# Altium project QANTUM_PROJECT.PrjPcb (part 3 of 3)

## Sheet 09-USBUart_PPSMUX_UARTMUX.SchDoc
size 594 x 420 mm; SPICEModelCacheLIOYUQKN: <root> / <DocumentId>LIOYUQKN</DocumentId> / <CacheFrame Number="0"> / <Model Name="emk105bj105_v-f" Kind="CKT"> / <Text>* EMK105BJ105_V-F     SPICE MODEL  ( General Type ) / *-------------------------------------------------------------------------------------------------------- / * Model Generated by TAIYO YUDEN Corporation (http://www.ty-top.com) / * Version 1.0 / * TAIYO YUDEN Control No. 170508_130520 / * Copyright(c) 2012 TAIYO YUDEN CO.,LTD. All Rights Reserved. / *-------------------------------------------------------------------------------------------------------- / * / * Products Name : Multilayer Ceramic Capacitors / * / * Characteristics : / *     Capacitance : 1 uF , Rated Voltage : 16V , TCC : X5R / *     Case Size : 1.0 x 0.5 / 0.039 x 0.02 [mm/inch] , Thickness : 0.5 / 0.02 [mm/inch] / *     (Conditions: Temperature = 25 degC , DC Bias Current/Voltage = 0A / 0V) / * / * Frequency Range : 40Hz - 3GHz / * / * External Node Assignments : / * / *  1  o---| |---o  2 / * / *-------------------------------------------------------------------------------------------------------- / .SubCkt EMK105BJ105_V-F 1 2 / **************************** / C0 1 110 0.68309u / Cm 1 101 0.26053u / C1 101 102 0.94076u / Rc1 101 102 1.9029k / C2 102 103 0.66707u / Rc2 102 103 120.36 / C3 103 110 0.57203u / Rc3 103 110 2.1097 / C2m 1 301 0.1871u / C21 301 302 3.2494u / Rc21 301 302 1.1117k / C22 302 303 2.1014u / Rc22 302 303 1.484k / C23 303 304 2.1172u / Rc23 303 304 1.3876k / C24 304 305 0.75729u / Rc24 304 305 332.59 / C25 305 306 0.94401u / Rc25 305 306 249.09 / C26 306 307 0.34674u / Rc26 306 307 28.352 / C27 307 308 0.37158u / Rc27 307 308 19.989 / C28 308 309 0.17933u / Rc28 308 309 31.748 / C29 309 110 0.016445u / Rc29 309 110 1.0592 / Rp0 1 110 100Meg / L0 110 120 0.2216n / Lm 120 130 0.1509n / L1 120 121 0.12659n / RL1 121 130 0.85161 / L2 120 122 0.15996n / RL2 122 130 0.42469 / L3 120 123 7.9543n / RL3 123 130 0.54643m / CR 120 124 0.24334u / LR 124 125 0.090738n / RR 125 130 68.076m / CL 130 140 2.7354p / LL 130 140 0.10762n / RL 130 140 50.614 / Rs 140 2 7.5416m / **************************** / .ends EMK105BJ105_V-F</Text> / </Model> / </CacheFrame> / </root>
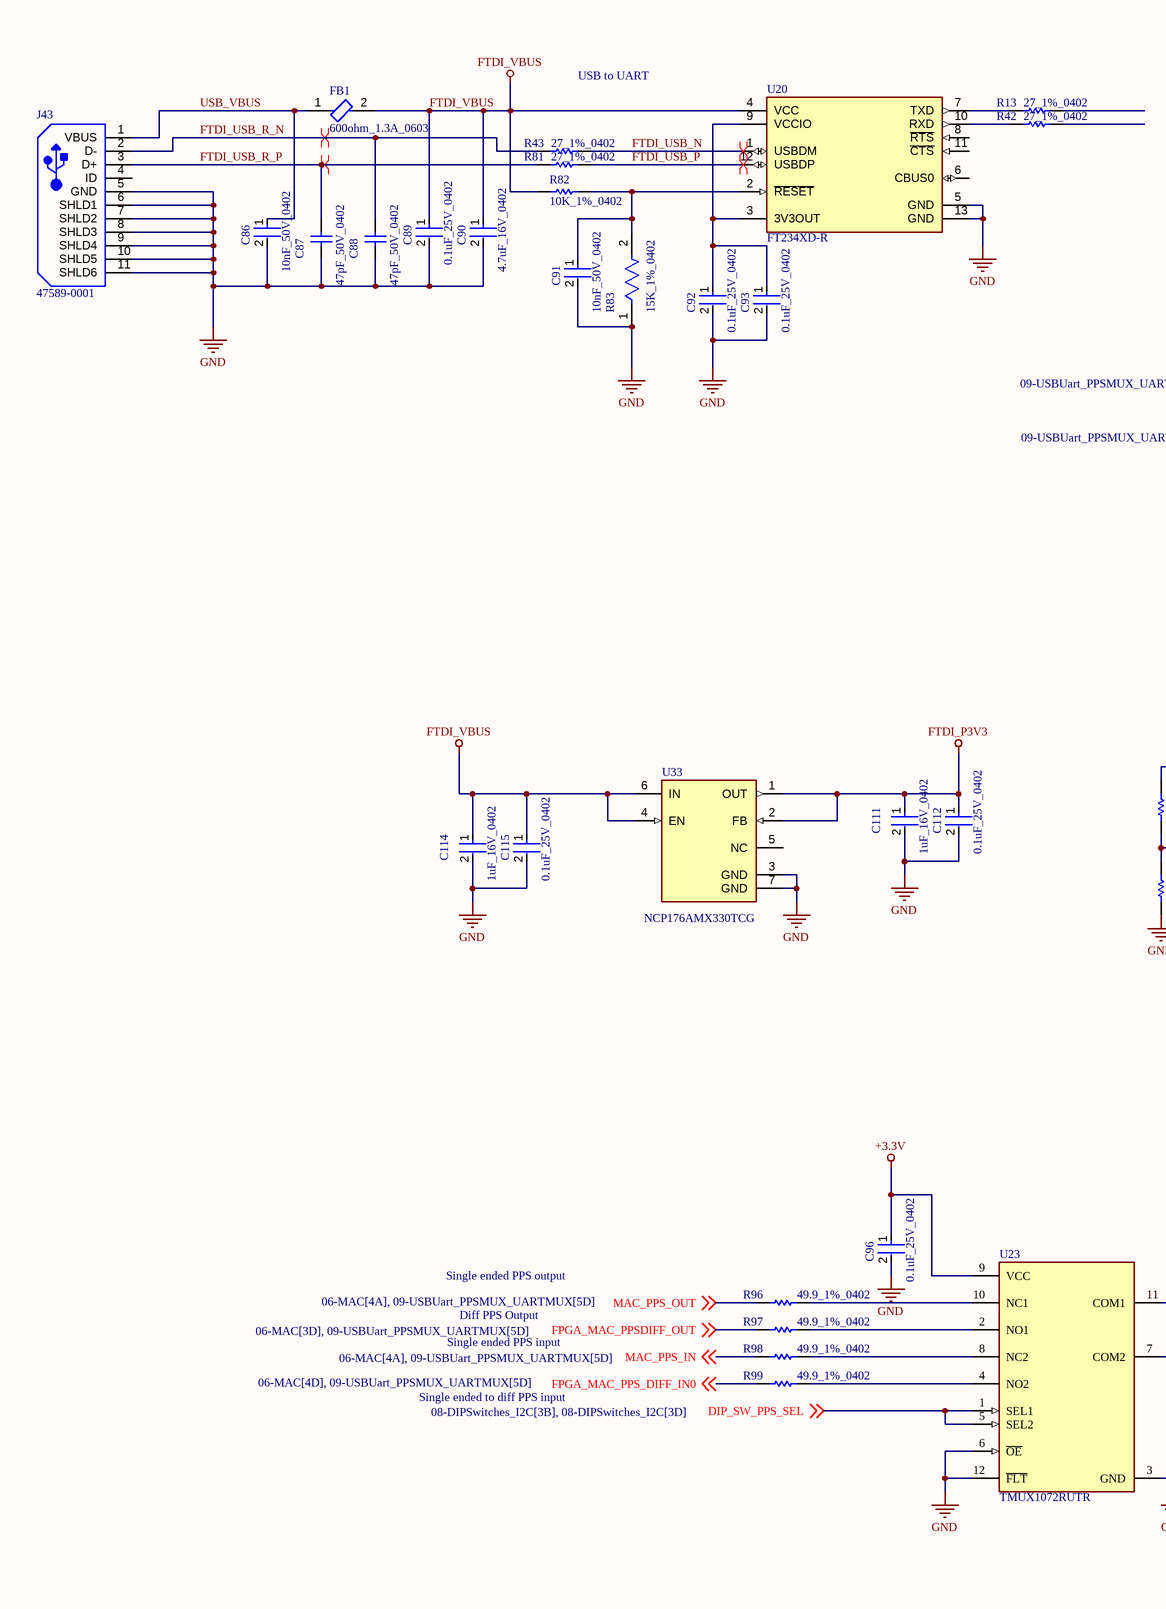
[diagram p10: 09-USBUart_PPSMUX_UARTMUX.SchDoc, left]
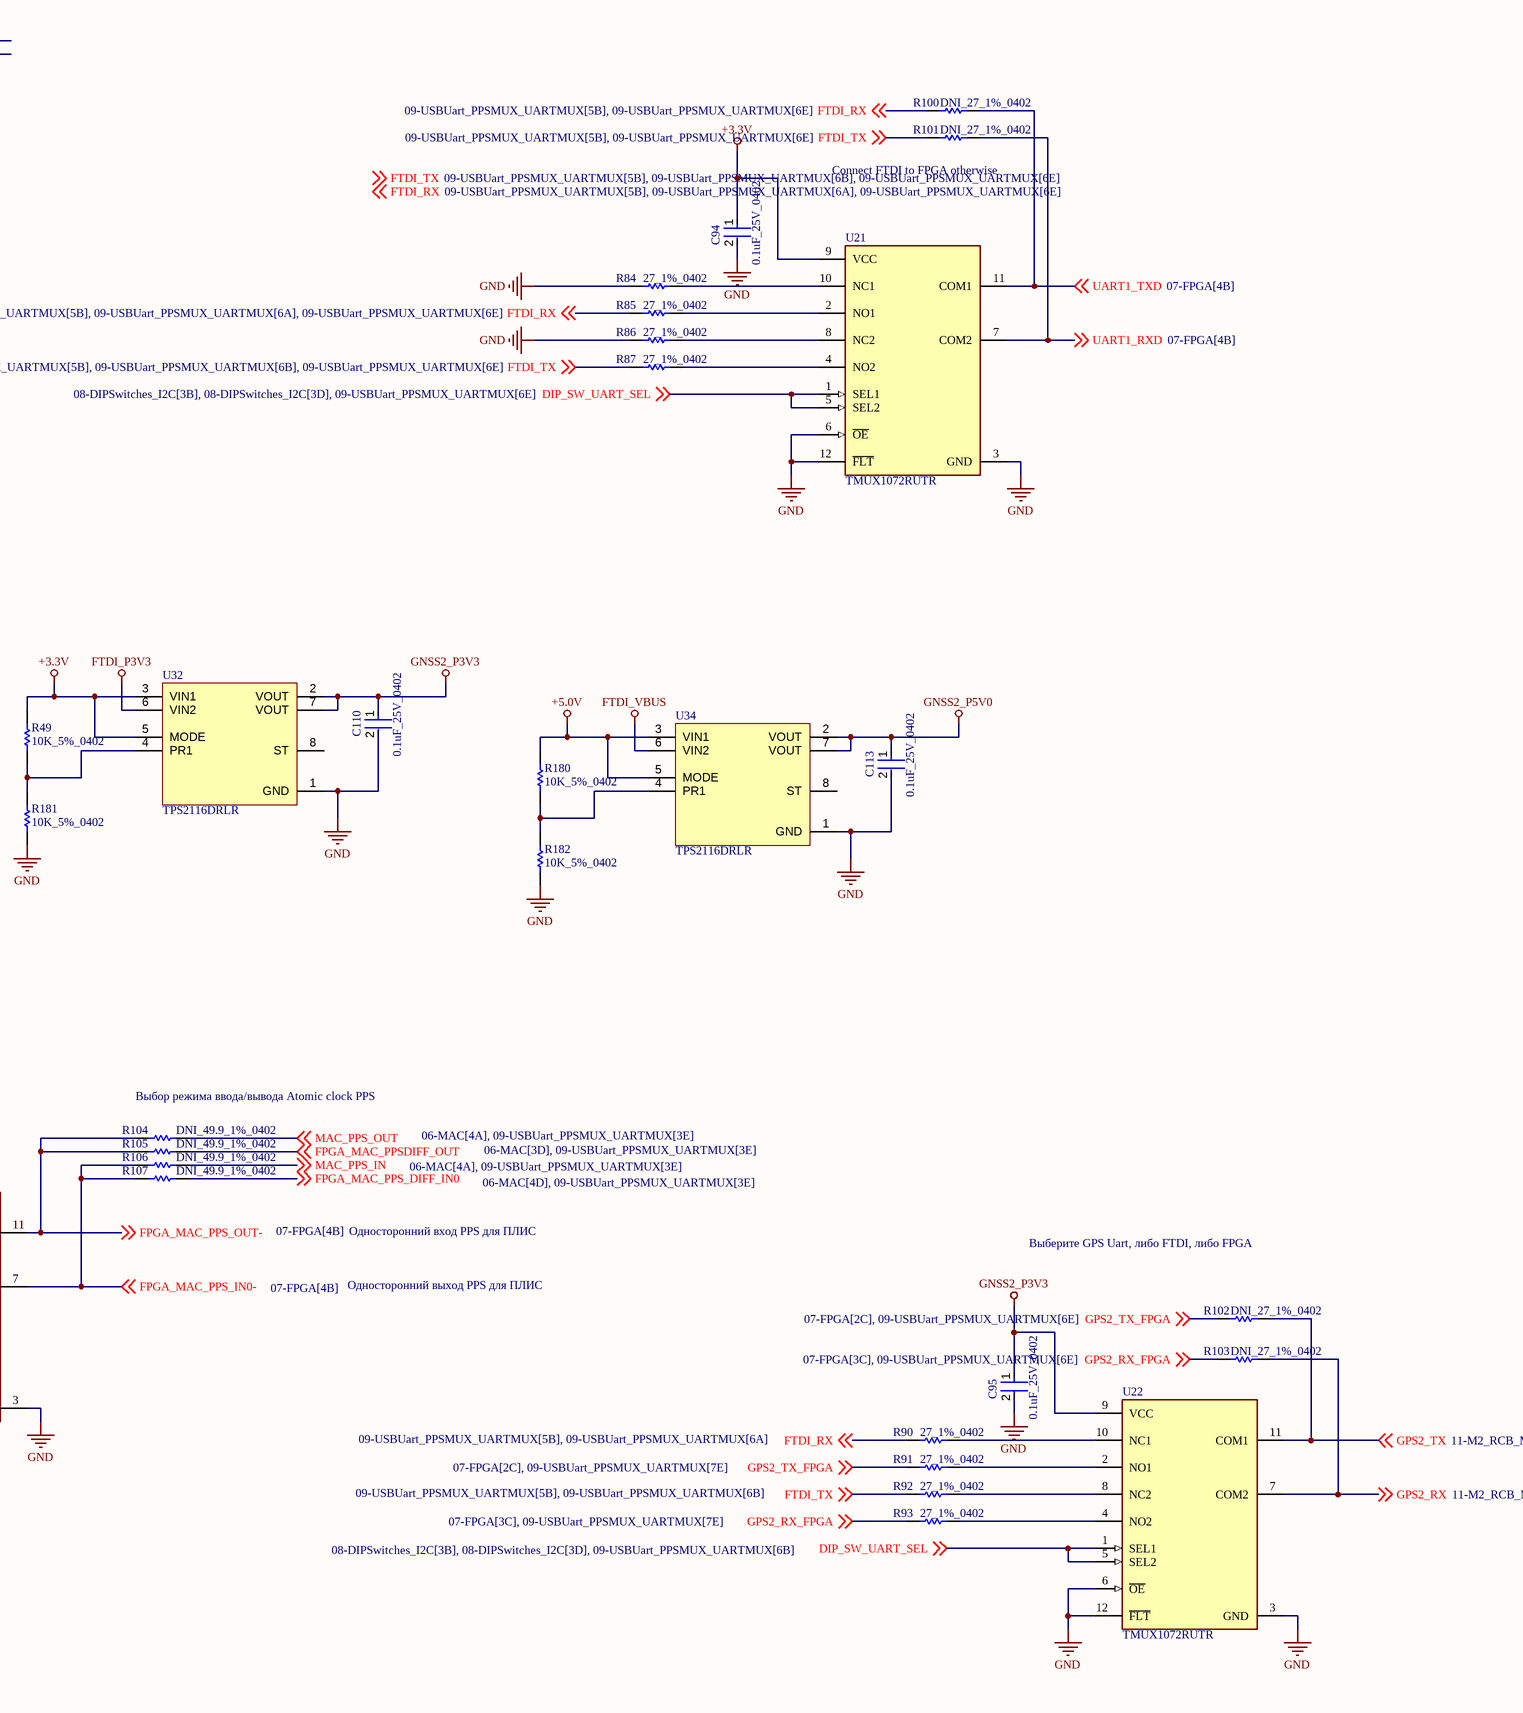
[diagram p11: 09-USBUart_PPSMUX_UARTMUX.SchDoc, right]

### Parts
C86  10nF_50V_0402  [FP-CC0402-MFG]
C87  47pF_50V_0402  [CAPC1005X55X25LL05T10]
C88  47pF_50V_0402  [CAPC1005X55X25LL05T10]
C89  0.1uF_25V_0402  [FP-0402-L_1_0_1-W_0_5_0_1-IPC_C]
C90  4.7uF_16V_0402  [FP-CL829-IPC_C]
C91  10nF_50V_0402  [FP-CC0402-MFG]
C92  0.1uF_25V_0402  [FP-0402-L_1_0_1-W_0_5_0_1-IPC_C]
C93  0.1uF_25V_0402  [FP-0402-L_1_0_1-W_0_5_0_1-IPC_C]
C94  0.1uF_25V_0402  [FP-0402-L_1_0_1-W_0_5_0_1-IPC_C]
C95  0.1uF_25V_0402  [FP-0402-L_1_0_1-W_0_5_0_1-IPC_C]
C96  0.1uF_25V_0402  [FP-0402-L_1_0_1-W_0_5_0_1-IPC_C]
C110  0.1uF_25V_0402  [FP-0402-L_1_0_1-W_0_5_0_1-IPC_C]
C111  1uF_16V_0402  [FP-0402-L_1_0_0_05-W_0_5-IPC_A]
C112  0.1uF_25V_0402  [FP-0402-L_1_0_1-W_0_5_0_1-IPC_C]
C113  0.1uF_25V_0402  [FP-0402-L_1_0_1-W_0_5_0_1-IPC_C]
C114  1uF_16V_0402  [FP-0402-L_1_0_0_05-W_0_5-IPC_A]
C115  0.1uF_25V_0402  [FP-0402-L_1_0_1-W_0_5_0_1-IPC_C]
FB1  600ohm_1.3A_0603  [FP-BLM18-0_15-t0_8-IPC_A]
J43  47589-0001  [MOLX-47589-0001_V]
R13  27_1%_0402  [RESC1005X40X25NL05T05]
R42  27_1%_0402  [RESC1005X40X25NL05T05]
R43  27_1%_0402  [RESC1005X40X25NL05T05]
R49  10K_5%_0402  [RESC1005X40X25ML05T05]
R81  27_1%_0402  [RESC1005X40X25NL05T05]
R82  10K_1%_0402  [RESC1005X40X25LL05T10]
R83  15K_1%_0402  [FP-ERJ2R-MFG]
R84  27_1%_0402  [RESC1005X40X25NL05T05]
R85  27_1%_0402  [RESC1005X40X25NL05T05]
R86  27_1%_0402  [RESC1005X40X25NL05T05]
R87  27_1%_0402  [RESC1005X40X25NL05T05]
R90  27_1%_0402  [RESC1005X40X25NL05T05]
R91  27_1%_0402  [RESC1005X40X25NL05T05]
R92  27_1%_0402  [RESC1005X40X25NL05T05]
R93  27_1%_0402  [RESC1005X40X25NL05T05]
R96  49.9_1%_0402  [RESC1005X40X25LL05T10]
R97  49.9_1%_0402  [RESC1005X40X25LL05T10]
R98  49.9_1%_0402  [RESC1005X40X25LL05T10]
R99  49.9_1%_0402  [RESC1005X40X25LL05T10]
R100  DNI_27_1%_0402  [RESC1005X40X25NL05T05]  (no BOM)
R101  DNI_27_1%_0402  [RESC1005X40X25NL05T05]  (no BOM)
R102  DNI_27_1%_0402  [RESC1005X40X25NL05T05]  (no BOM)
R103  DNI_27_1%_0402  [RESC1005X40X25NL05T05]  (no BOM)
R104  DNI_49.9_1%_0402  [RESC1005X40X25LL05T10]  (no BOM)
R105  DNI_49.9_1%_0402  [RESC1005X40X25LL05T10]  (no BOM)
R106  DNI_49.9_1%_0402  [RESC1005X40X25LL05T10]  (no BOM)
R107  DNI_49.9_1%_0402  [RESC1005X40X25LL05T10]  (no BOM)
R180  10K_5%_0402  [RESC1005X40X25ML05T05]
R181  10K_5%_0402  [RESC1005X40X25ML05T05]
R182  10K_5%_0402  [RESC1005X40X25ML05T05]
U20  FT234XD-R  [FP-DFN-12-IPC_B]
U21  TMUX1072RUTR  [FP-RUT0012A-MFG]
U22  TMUX1072RUTR  [FP-RUT0012A-MFG]
U23  TMUX1072RUTR  [FP-RUT0012A-MFG]
U32  TPS2116DRLR  [IC_TPS2116]
U33  NCP176AMX330TCG  [FP-711AT-MFG]
U34  TPS2116DRLR  [IC_TPS2116]

### Nets
+3.3V: C94.1 C96.1 R49.2 U21.9(VCC) U23.9(VCC) U32.3(VIN1) U32.5(MODE)
+5.0V: R180.2 U34.3(VIN1) U34.5(MODE)
FTDI_P3V3: C111.1 C112.1 U32.6(VIN2) U33.1(OUT) U33.2(FB)
FTDI_VBUS: C89.1 C90.1 C114.1 C115.1 FB1.2 R82.2 U20.4(VCC) U33.4(EN) U33.6(IN) U34.6(VIN2)
GND: C86.2 C87.1 C88.1 C89.2 C90.2 C91.2 C92.2 C93.2 C94.2 C95.2 C96.2 C110.2 C111.2 C112.2 C113.2 C114.2 C115.2 J43.5(GND) J43.6(SHLD1) J43.7(SHLD2) J43.8(SHLD3) J43.9(SHLD4) J43.10(SHLD5) J43.11(SHLD6) R83.1 R84.1 R86.1 R181.1 R182.1 U20.5(GND) U20.13(GND) U21.3(GND) U21.6(~{OE}) U21.12(~{FLT}) U22.3(GND) U22.6(~{OE}) U22.12(~{FLT}) U23.3(GND) U23.6(~{OE}) U23.12(~{FLT}) U32.1(GND) U33.3(GND) U33.7(GND) U34.1(GND)
GNSS2_P3V3: C95.1 C110.1 U22.9(VCC) U32.2(VOUT) U32.7(VOUT)
GNSS2_P5V0: C113.1 U34.2(VOUT) U34.7(VOUT)
DIP_SW_PPS_SEL: U23.1(SEL1) U23.5(SEL2) ; off-sheet DIP_SW_PPS_SEL
DIP_SW_UART_SEL: U21.1(SEL1) U21.5(SEL2) U22.1(SEL1) U22.5(SEL2) ; off-sheet DIP_SW_UART_SEL
FPGA_MAC_PPS_DIFF_IN0: R99.1 R107.2 ; off-sheet FPGA_MAC_PPS_DIFF_IN0
FPGA_MAC_PPS_IN0-: R106.1 R107.1 U23.7(COM2) ; off-sheet FPGA_MAC_PPS_IN0-
FPGA_MAC_PPS_OUT-: R104.1 R105.1 U23.11(COM1) ; off-sheet FPGA_MAC_PPS_OUT-
FPGA_MAC_PPSDIFF_OUT: R97.1 R105.2 ; off-sheet FPGA_MAC_PPSDIFF_OUT
FTDI_RX: R85.1 R90.1 R100.1 ; off-sheet FTDI_RX
FTDI_TX: R87.1 R92.1 R101.1 ; off-sheet FTDI_TX
FTDI_USB_N: R43.2 U20.1(USBDM)
FTDI_USB_P: R81.2 U20.12(USBDP)
FTDI_USB_R_N: C88.2 J43.2(D-) R43.1
FTDI_USB_R_P: C87.2 J43.3(D+) R81.1
GPS2_RX: R103.2 U22.7(COM2) ; off-sheet GPS2_RX
GPS2_RX_FPGA: R93.1 R103.1 ; off-sheet GPS2_RX_FPGA
GPS2_TX: R102.2 U22.11(COM1) ; off-sheet GPS2_TX
GPS2_TX_FPGA: R91.1 R102.1 ; off-sheet GPS2_TX_FPGA
MAC_PPS_IN: R98.1 R106.2 ; off-sheet MAC_PPS_IN
MAC_PPS_OUT: R96.1 R104.2 ; off-sheet MAC_PPS_OUT
UART1_RXD: R101.2 U21.7(COM2) ; off-sheet UART1_RXD
UART1_TXD: R100.2 U21.11(COM1) ; off-sheet UART1_TXD
USB_VBUS: C86.1 FB1.1 J43.1(VBUS)
NetC91_1: C91.1 R82.1 R83.2 U20.2(~{RESET})
NetC92_1: C92.1 C93.1 U20.3(3V3OUT) U20.9(VCCIO)
NetR13_1: R13.1 U20.7(TXD)
NetR42_1: R42.1 U20.10(RXD)
NetR49_1: R49.1 R181.2 U32.4(PR1)
NetR84_2: R84.2 U21.10(NC1)
NetR85_2: R85.2 U21.2(NO1)
NetR86_2: R86.2 U21.8(NC2)
NetR87_2: R87.2 U21.4(NO2)
NetR90_2: R90.2 U22.10(NC1)
NetR91_2: R91.2 U22.2(NO1)
NetR92_2: R92.2 U22.8(NC2)
NetR93_2: R93.2 U22.4(NO2)
NetR96_2: R96.2 U23.10(NC1)
NetR97_2: R97.2 U23.2(NO1)
NetR98_2: R98.2 U23.8(NC2)
NetR99_2: R99.2 U23.4(NO2)
NetR180_1: R180.1 R182.2 U34.4(PR1)

Not connected (* = marked no-connect by the designer): J43 4(ID); R13 2; R42 2; U20 6(CBUS0) 8(~{RTS}) 11(~{CTS}); U32 8(ST); U33 5(NC); U34 8(ST)

### Layout directives
differential pair: FTDI_USB_N, FTDI_USB_P, FTDI_USB_R_N, FTDI_USB_R_P

### Notes on the sheet
- USB to UART
- (near R101) Connect FTDI to FPGA otherwise
- Выбор режима ввода/вывода Atomic clock PPS
- Single ended PPS output
- Diff PPS Output
- Односторонний вход PPS для ПЛИС
- Выберите GPS Uart, либо FTDI, либо FPGA
- Single ended PPS input
- Односторонний выход PPS для ПЛИС
- Single ended to diff PPS input
- Labels drawn without touching a wire or pin: FTDI_RX, FTDI_TX
- DWG NO:
- REV:
- REVISION
- DESCRIPTION
- DATE
- APPROVED

### Library data of the parts
C86 C91 = CMP-2100-03592-2: CAP CER 10000PF 50V X7R 0402; Manufacturer Part Number: CC0402KRX7R9BB103; Manufacturer: YAGEO; Temperature Coefficient: 30ppm/°C; Capacitance: 10 nF; Material: Ceramic; Automotive Grade: NA; Tolerance: 0.1; Value: 10 nF; Device Class L3: Ceramic Capacitors; Temperature: -55°C to +125°C; Footprint Url: http://www.yageo.com/exep/pages/download/literatures/UPY-C_GEN_24.pdf; Ipc Land Pattern Name: CAPC10050X50; Device Class L1: Passive Components; Automotive: No; Octopart: https://octopart.com/cc0402krx7r9bb103-yageo-8376513; Lead Free: Yes; Temperature Range Low: -55°C; Height: 0.55mm; ComponentLink2URL: http://www.yageo.com/documents/recent/UPY-GP_NP0_16V-to-50V_16.pdf; Category: Cap; ComponentLink2Description: Datasheet; Temperature Range High: +125°C; Digikey Description: CAP CER 10000PF 50V X7R 0402; Voltage Rating: 50 V; Package: CC0402; Device Class L2: Capacitors; Mouser Description: 0402 10 nF 50 V ±10 % Tolerance X7R SMT Multilayer Ceramic Capacitor; RoHS: TRUE; Temperature Characteristic: X7R
C87 C88 = CMP-2008-04368-1: Part Number: GRM1555C1H470JA01D; Manufacturer: Murata
C89 C92-C96 C110 C112 C113 C115 = CMP-2008-02519-2: General Purpose Ceramic Capacitor, 0402, 100nF, 10%, X7R, 15%, 25V; Package Quantity: 1; Capacitance: 100nF; Min Operating Temperature: -55°C; Voltage: 25V; Voltage Rating: 25V; Construction: Flat; Max Operating Temperature: 125°C; Radiation Hardening: No; Depth: 0.5mm; Thickness: 0.022inch; Voltage Rating (DC): 25V; Number of Pins: 2; Lead Free: Lead Free; Series: -; REACH SVHC: No SVHC; Length: 1mm; Dielectric: X7R; RoHS Compliant: Yes; Mount: Surface Mount; Packaging: Tape and Reel; Case/Package: 0402; Case Code (Imperial): 0402; Termination: SMD/SMT; Width: 0.02inch; Case Code (Metric): 1005; Tolerance: 10%
C90 = CMP-13271-001468-1: Cap Ceramic 4.7uF 16V X5R ±20% SMD 0402 +85°C Paper T/R; Mount: Surface Mount; Case Code (Metric): 1005; Case/Package: 0402; Length: 0.039inch; Capacitance: 4.7uF; Voltage Rating: 16V; Max Operating Temperature: 85°C; Tolerance: 20%; Thickness: 0.022inch; Min Operating Temperature: -55°C; Case Code (Imperial): 0402; Packaging: Tape and Reel; Width: 0.02inch
C111 C114 = CMP-14477-000104-2: None; Tolerance: 10%; Voltage Rating: 16V; Dielectric: X5R; Capacitance: 1uF; Packaging: Tape and Reel; Depth: 0.5mm; Mount: Surface Mount; Thickness: 0.022inch; Package Quantity: 1; Min Operating Temperature: -55°C; Series: M; Voltage Rating (DC): 16V; Termination: SMD/SMT; Case/Package: 0402; Number of Pins: 2; Case Code (Imperial): 0402; Length: 1mm; Halogen Free: Halogen Free; Case Code (Metric): 1005; Width: 0.02inch; RoHS Compliant: Yes; Radiation Hardening: No; Max Operating Temperature: 85°C; Height: 0.5mm; Construction: Flat
FB1 = CMP-0686-00581-3: Chip Ferrite Bead, 0603, 600Ω @ 100MHz, 0.15Ω, 25%, 1.3A; Material: Steel; Number of Lines: 1; Impedance: 600R; DC Resistance (DCR): 150mR; Tolerance: 25%; Case Code (Metric): 1608; Width: 0.8mm; DC Current: 1.3A; Max DC Current: 1.3A; Package Quantity: 1; Number of Pins: 2; Military Standard: Not; RoHS Compliant: Yes; Termination: SMD/SMT; Max Operating Temperature: 125°C; Length: 1.6mm; Depth: 0.8mm; Case Code (Imperial): 0603; Series: BLM18K; Inductor Type: FERRITE BEAD; Core Material: Ferrite; Number of Circuits: 1; Height: 0.8mm; Case/Package: 0603; REACH SVHC: No SVHC; Packaging: Tape and Reel; Min Operating Temperature: -55°C; Max Current Rating: 1.3A; Radiation Hardening: No; Current Rating: 1.3A; Lead Free: Lead Free; Test Frequency: 100MHz; Weight: 7.1E-05oz
J43 = CMP-2000-05610-1: Right Angle Female Type AB Micro USB Connector, 30 V, 1.8 A, -30 to 85 degC, RoHS, Tape and Reel; Number of Ports: 1Port; Current Rating: 1.8A; Brand: Molex; Connector Type: MicroUSBTypeABreceptacle; Number of Contacts: 5Contact; Voltage Rating: 30VAC; Color: Black; Product: MicroUSBTypeABConnectors; Package URL: http://www.molex.com/pdm_docs/sd/475890001_sd.pdf; Contact Plating: Gold; Datasheet URL: http://www.molex.com/webdocs/datasheets/pdf/en-us/0475890001_IO_CONNECTORS.pdf; Operating Temperature Range: -20Cto+85C; Termination Style: SMD/SMT; Mounting Angle: Right; Package Reference: 47589-0001; Gender: Female; Package Description: Micro USB Connector, Pitch 0.65 mm, 5 Positions, Body 7.5 x 5.6 mm; Mounting Technology: SurfaceMount; Contact Material: CopperAlloy; Packaging: Reel; RoHS: True; Standard: USB; Manufacturer URL: http://www.molex.com/; Manufacturer: Molex; Datasheet Version: 12/2016; Product Category: USBConnectors; Series: 47589
R13 R42 R43 R81 R84-R87 R90-R93 R100-R103 = CMP-2002-08434-1: Part Number: CRCW040227R0FKED; Manufacturer: Vishay Dale
R49 R180-R182 = CMP-2002-00433-1: Part Number: ERJ-2GEJ103X; Manufacturer: Panasonic
R82 = CMP-2002-07353-1: Part Number: RC0402FR-0710KL; Manufacturer: Yageo / Phycomp
R83 = CMP-2002-00694-4: RES SMD 15K OHM 1% 1/10W 0402; Manufacturer Part Number: ERJ-2RKF1502X; Manufacturer: Panasonic; Automotive Grade: Grade 0; Voltage Rating: 50V; Resistance: 15kΩ; Temperature Coefficient: 100ppm/°C; Power Rating: 0.1W; Value: 15kΩ; ComponentLink2URL: https://industrial.panasonic.com/cdbs/www-data/pdf/RDA0000/AOA0000C304.pdf; Automotive: Yes; Temperature: -55°C to +155°C; Height: 0.4mm; Digikey Description: RES SMD 15K OHM 1% 1/10W 0402; Category: Res; Device Class L2: Resistors; Device Class L1: Passive Components; Package: ERJ2R; Temperature Range Low: -55°C; Tolerance: 1%; Series: ERJ; Footprint Url: https://b2b-api.panasonic.eu/file_stream/pids/fileversion/1180; Mouser Description: Res Thick Film 1.0 x 0.5 mm 15K Ohm 1% 0.1W(1/10W) 100ppm/ C Molded SMD Punched Carrier T/R; Composition: Thick Film; Lead Free: Yes; Device Class L3: Chip SMD Resistors; Octopart: https://octopart.com/erj-2rkf1502x-panasonic-55404985; RoHS: TRUE; Temperature Range High: +155°C; ComponentLink2Description: Datasheet
R96-R99 R104-R107 = CMP-2002-07709-1: Manufacturer: Yageo / Phycomp; Part Number: RC0402FR-0749R9L
U20 = CMP-0248-00027-3: IC USB SERIAL BASIC UART 12DFN; Min Supply Voltage: 2.97V; Number of Ports: 1; Operating Supply Voltage: 5V; Operating Supply Current: 8mA; Max Supply Voltage: 5.5V; Data Rate: 3Mbps; Length: 3mm; Case/Package: DFN; Mount: Surface Mount; Packaging: Tape and Reel; Max Operating Temperature: 85°C; Height: 0.75mm; Number of Pins: 12; Number of Transceivers: 1; Package Quantity: 5000; Min Operating Temperature: -40°C; Width: 3mm; REACH SVHC: No SVHC; Interface: UART; Lead Free: Lead Free
U21-U23 = CMP-04892-000114-1: IC SWITCH SPDT DUAL 12UQFN; Number of Circuits: 2; -3db Bandwidth: 1.2GHz; On-State Resistance: 18R; Number of Pins: 12; Min Operating Temperature: -40°C; RoHS Compliant: Yes; Max Operating Temperature: 125°C; Number of Channels: 2; Packaging: Tape and Reel
U32 U34 = IC_TPS2116DRLR: 1.6-V to 5.5-V, 40-mΩ, 2.5-A, low-IQ, priority power multiplexer 8-SOT-5X3 -40 to 125; MF: Texas Instruments; Check_prices: https://www.snapeda.com/parts/TPS2116DRLR/Texas%20Instruments/view-part/5674360/?ref=eda; MP: TPS2116DRLR; Package: Package; Price: None; Availability: No availability data; SnapEDA_Link: https://www.snapeda.com/parts/TPS2116DRLR/Texas%20Instruments/view-part/5674360/?ref=snap; Value: *; Supplier 1: LCSC; Manufacturer: Texas Instruments; Manufacturer Part Number: TPS2116DRLR; RoHS: Yes; Category: Voltage Supervisors; Stock 1: 562; Pricing 1: 1=0.6651, 10=0.5457, 30=0.4853, 100=0.4264, 500=0.3914, 1000=0.3723 (USD); Supplier Part Number 1: C3235557
U33 = CMP-07128-000022-1: IC REG LINEAR 3.3V 500MA 6XDFN; Manufacturer: ON Semiconductor; Output Type: Fixed; Dropout Voltage: 295mV; Number Of Outputs: 1; Standoff Height: 0mm; Min Supply Voltage: 1.4V; Nominal Supply Current: 60uA; Max Supply Voltage: 5.5V; Max Junction Temp: +150°C; Accuracy Percentage: 0.8%; Footprint Url: https://www.onsemi.com/pub/Collateral/711AT.PDF; Device Class L2: Power Management ICs; Device Class L1: Integrated Circuits (ICs); Digikey Description: IC REG LINEAR 3.3V 500MA 6XDFN; ComponentLink2Description: Datasheet; Output Voltage: 3.3V; ComponentLink2URL: https://www.onsemi.com/pub/Collateral/NCP176-D.PDF; RoHS: TRUE; Lead Free: Yes; Output Current: 500mA; Automotive: No; Temperature Range High: +150°C; Height: 0.45mm; Package: 711AT; Device Class L3: Voltage Regulators - Linear; Octopart: https://octopart.com/ncp176amx330tcg-on+semiconductor-61522616; Category: IC; Manufacturer Part Number: NCP176AMX330TCG; Ipc Land Pattern Name: DFN120X120X37-6; Temperature: to +150°C

## Sheet 11-M2_RCB_MUX.SchDoc
size 594 x 420 mm
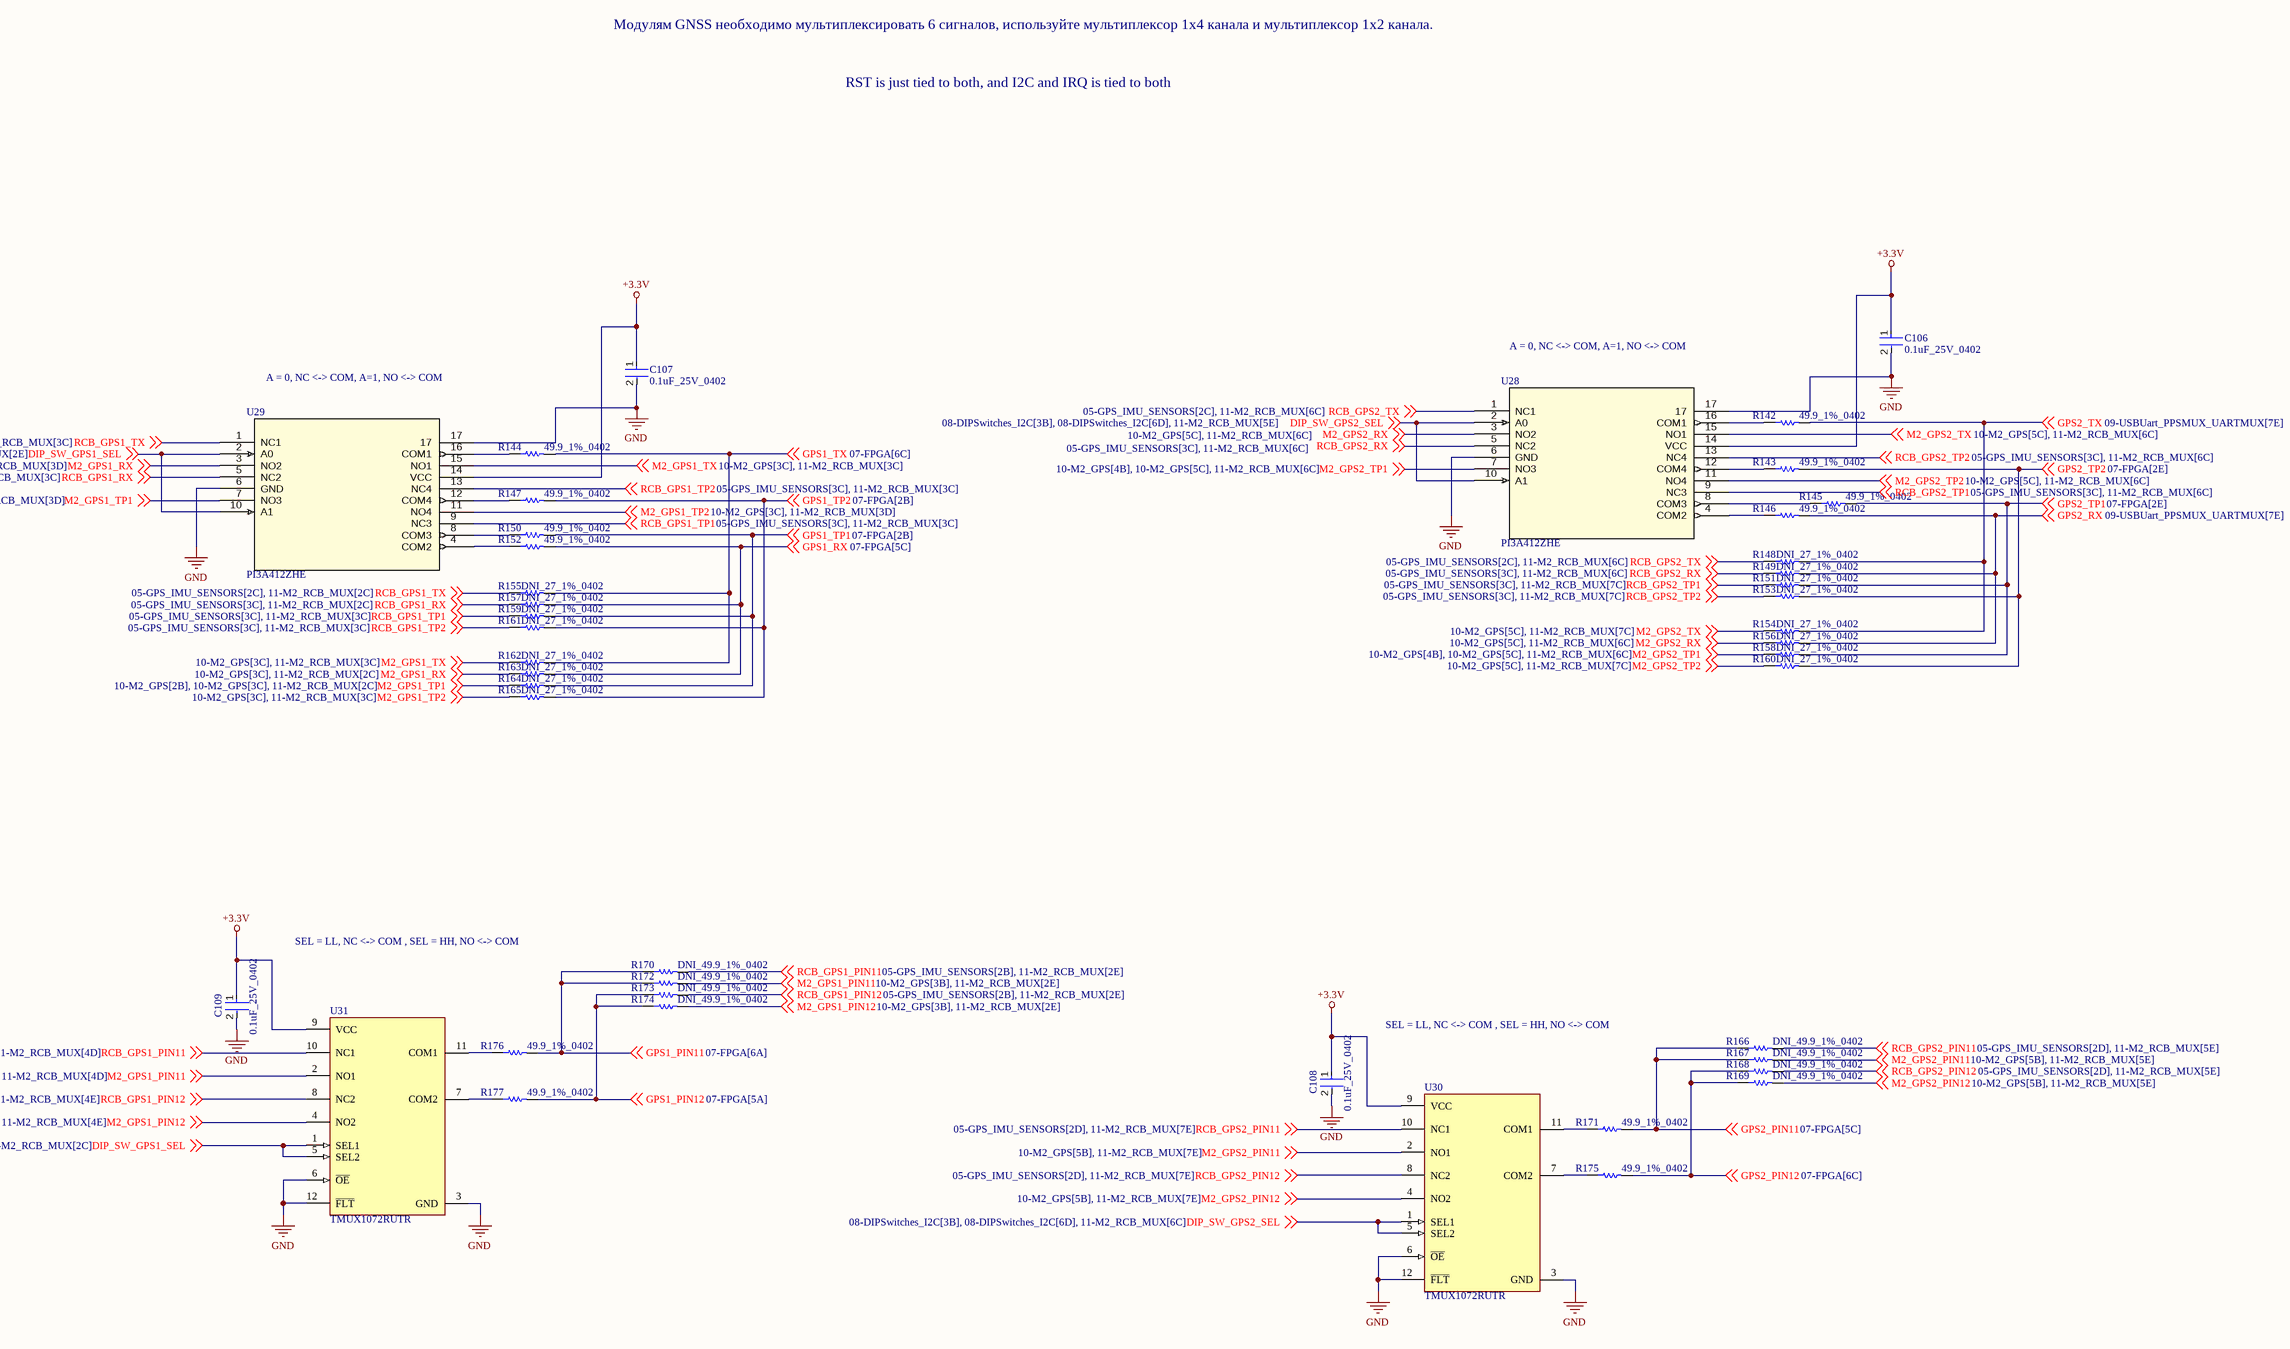
[diagram p12: 11-M2_RCB_MUX.SchDoc]

### Parts
C106  0.1uF_25V_0402  [FP-0402-L_1_0_1-W_0_5_0_1-IPC_C]
C107  0.1uF_25V_0402  [FP-0402-L_1_0_1-W_0_5_0_1-IPC_C]
C108  0.1uF_25V_0402  [FP-0402-L_1_0_1-W_0_5_0_1-IPC_C]
C109  0.1uF_25V_0402  [FP-0402-L_1_0_1-W_0_5_0_1-IPC_C]
R142  49.9_1%_0402  [RESC1005X40X25LL05T10]
R143  49.9_1%_0402  [RESC1005X40X25LL05T10]
R144  49.9_1%_0402  [RESC1005X40X25LL05T10]
R145  49.9_1%_0402  [RESC1005X40X25LL05T10]
R146  49.9_1%_0402  [RESC1005X40X25LL05T10]
R147  49.9_1%_0402  [RESC1005X40X25LL05T10]
R148  DNI_27_1%_0402  [RESC1005X40X25NL05T05]  (no BOM)
R149  DNI_27_1%_0402  [RESC1005X40X25NL05T05]  (no BOM)
R150  49.9_1%_0402  [RESC1005X40X25LL05T10]
R151  DNI_27_1%_0402  [RESC1005X40X25NL05T05]  (no BOM)
R152  49.9_1%_0402  [RESC1005X40X25LL05T10]
R153  DNI_27_1%_0402  [RESC1005X40X25NL05T05]  (no BOM)
R154  DNI_27_1%_0402  [RESC1005X40X25NL05T05]  (no BOM)
R155  DNI_27_1%_0402  [RESC1005X40X25NL05T05]  (no BOM)
R156  DNI_27_1%_0402  [RESC1005X40X25NL05T05]  (no BOM)
R157  DNI_27_1%_0402  [RESC1005X40X25NL05T05]  (no BOM)
R158  DNI_27_1%_0402  [RESC1005X40X25NL05T05]  (no BOM)
R159  DNI_27_1%_0402  [RESC1005X40X25NL05T05]  (no BOM)
R160  DNI_27_1%_0402  [RESC1005X40X25NL05T05]  (no BOM)
R161  DNI_27_1%_0402  [RESC1005X40X25NL05T05]  (no BOM)
R162  DNI_27_1%_0402  [RESC1005X40X25NL05T05]  (no BOM)
R163  DNI_27_1%_0402  [RESC1005X40X25NL05T05]  (no BOM)
R164  DNI_27_1%_0402  [RESC1005X40X25NL05T05]  (no BOM)
R165  DNI_27_1%_0402  [RESC1005X40X25NL05T05]  (no BOM)
R166  DNI_49.9_1%_0402  [RESC1005X40X25LL05T10]  (no BOM)
R167  DNI_49.9_1%_0402  [RESC1005X40X25LL05T10]  (no BOM)
R168  DNI_49.9_1%_0402  [RESC1005X40X25LL05T10]  (no BOM)
R169  DNI_49.9_1%_0402  [RESC1005X40X25LL05T10]  (no BOM)
R170  DNI_49.9_1%_0402  [RESC1005X40X25LL05T10]  (no BOM)
R171  49.9_1%_0402  [RESC1005X40X25LL05T10]
R172  DNI_49.9_1%_0402  [RESC1005X40X25LL05T10]  (no BOM)
R173  DNI_49.9_1%_0402  [RESC1005X40X25LL05T10]  (no BOM)
R174  DNI_49.9_1%_0402  [RESC1005X40X25LL05T10]  (no BOM)
R175  49.9_1%_0402  [RESC1005X40X25LL05T10]
R176  49.9_1%_0402  [RESC1005X40X25LL05T10]
R177  49.9_1%_0402  [RESC1005X40X25LL05T10]
U28  PI3A412ZHE  [ZH16_PER]
U29  PI3A412ZHE  [ZH16_PER]
U30  TMUX1072RUTR  [FP-RUT0012A-MFG]
U31  TMUX1072RUTR  [FP-RUT0012A-MFG]

### Nets
+3.3V: C106.1 C107.1 C108.1 C109.1 U28.14(VCC) U29.14(VCC) U30.9(VCC) U31.9(VCC)
GND: C106.2 C107.2 C108.2 C109.2 U28.6(GND) U28.17 U29.6(GND) U29.17 U30.3(GND) U30.6(~{OE}) U30.12(~{FLT}) U31.3(GND) U31.6(~{OE}) U31.12(~{FLT})
DIP_SW_GPS1_SEL: U29.2(A0) U29.10(A1) U31.1(SEL1) U31.5(SEL2) ; off-sheet DIP_SW_GPS1_SEL
DIP_SW_GPS2_SEL: U28.2(A0) U28.10(A1) U30.1(SEL1) U30.5(SEL2) ; off-sheet DIP_SW_GPS2_SEL
GPS1_PIN11: R170.1 R172.1 R176.2 ; off-sheet GPS1_PIN11
GPS1_PIN12: R173.1 R174.1 R177.2 ; off-sheet GPS1_PIN12
GPS1_RX: R152.2 R157.2 R163.2 ; off-sheet GPS1_RX
GPS1_TP1: R150.2 R159.2 R164.2 ; off-sheet GPS1_TP1
GPS1_TP2: R147.2 R161.2 R165.2 ; off-sheet GPS1_TP2
GPS1_TX: R144.2 R155.2 R162.2 ; off-sheet GPS1_TX
GPS2_PIN11: R166.1 R167.1 R171.2 ; off-sheet GPS2_PIN11
GPS2_PIN12: R168.1 R169.1 R175.2 ; off-sheet GPS2_PIN12
GPS2_RX: R146.2 R149.2 R156.2 ; off-sheet GPS2_RX
GPS2_TP1: R145.2 R151.2 R158.2 ; off-sheet GPS2_TP1
GPS2_TP2: R143.2 R153.2 R160.2 ; off-sheet GPS2_TP2
GPS2_TX: R142.2 R148.2 R154.2 ; off-sheet GPS2_TX
M2_GPS1_PIN11: R172.2 U31.2(NO1) ; off-sheet M2_GPS1_PIN11
M2_GPS1_PIN12: R174.2 U31.4(NO2) ; off-sheet M2_GPS1_PIN12
M2_GPS1_RX: R163.1 U29.3(NO2) ; off-sheet M2_GPS1_RX
M2_GPS1_TP1: R164.1 U29.7(NO3) ; off-sheet M2_GPS1_TP1
M2_GPS1_TP2: R165.1 U29.11(NO4) ; off-sheet M2_GPS1_TP2
M2_GPS1_TX: R162.1 U29.15(NO1) ; off-sheet M2_GPS1_TX
M2_GPS2_PIN11: R167.2 U30.2(NO1) ; off-sheet M2_GPS2_PIN11
M2_GPS2_PIN12: R169.2 U30.4(NO2) ; off-sheet M2_GPS2_PIN12
M2_GPS2_RX: R156.1 U28.3(NO2) ; off-sheet M2_GPS2_RX
M2_GPS2_TP1: R158.1 U28.7(NO3) ; off-sheet M2_GPS2_TP1
M2_GPS2_TP2: R160.1 U28.11(NO4) ; off-sheet M2_GPS2_TP2
M2_GPS2_TX: R154.1 U28.15(NO1) ; off-sheet M2_GPS2_TX
RCB_GPS1_PIN11: R170.2 U31.10(NC1) ; off-sheet RCB_GPS1_PIN11
RCB_GPS1_PIN12: R173.2 U31.8(NC2) ; off-sheet RCB_GPS1_PIN12
RCB_GPS1_RX: R157.1 U29.5(NC2) ; off-sheet RCB_GPS1_RX
RCB_GPS1_TP1: R159.1 U29.9(NC3) ; off-sheet RCB_GPS1_TP1
RCB_GPS1_TP2: R161.1 U29.13(NC4) ; off-sheet RCB_GPS1_TP2
RCB_GPS1_TX: R155.1 U29.1(NC1) ; off-sheet RCB_GPS1_TX
RCB_GPS2_PIN11: R166.2 U30.10(NC1) ; off-sheet RCB_GPS2_PIN11
RCB_GPS2_PIN12: R168.2 U30.8(NC2) ; off-sheet RCB_GPS2_PIN12
RCB_GPS2_RX: R149.1 U28.5(NC2) ; off-sheet RCB_GPS2_RX
RCB_GPS2_TP1: R151.1 U28.9(NC3) ; off-sheet RCB_GPS2_TP1
RCB_GPS2_TP2: R153.1 U28.13(NC4) ; off-sheet RCB_GPS2_TP2
RCB_GPS2_TX: R148.1 U28.1(NC1) ; off-sheet RCB_GPS2_TX
NetR142_1: R142.1 U28.16(COM1)
NetR143_1: R143.1 U28.12(COM4)
NetR144_1: R144.1 U29.16(COM1)
NetR145_1: R145.1 U28.8(COM3)
NetR146_1: R146.1 U28.4(COM2)
NetR147_1: R147.1 U29.12(COM4)
NetR150_1: R150.1 U29.8(COM3)
NetR152_1: R152.1 U29.4(COM2)
NetR171_1: R171.1 U30.11(COM1)
NetR175_1: R175.1 U30.7(COM2)
NetR176_1: R176.1 U31.11(COM1)
NetR177_1: R177.1 U31.7(COM2)

### Notes on the sheet
- Модулям GNSS необходимо мультиплексировать 6 сигналов, используйте мультиплексор 1x4 канала и мультиплексор 1x2 канала.
- RST is just tied to both, and I2C and IRQ is tied to both
- A = 0, NC <-> COM, A=1, NO <-> COM
- SEL = LL, NC <-> COM , SEL = HH, NO <-> COM
- DWG NO:
- REV:
- REVISION
- DESCRIPTION
- DATE
- APPROVED

### Library data of the parts
C106-C109 = CMP-2008-02519-2: as C89 on sheet 09-USBUart_PPSMUX_UARTMUX; Package Quantity: 1; Capacitance: 100nF; Min Operating Temperature: -55°C; Voltage: 25V; Voltage Rating: 25V; Construction: Flat; Max Operating Temperature: 125°C; Radiation Hardening: No; Depth: 0.5mm; Thickness: 0.022inch; Voltage Rating (DC): 25V; Number of Pins: 2; Lead Free: Lead Free; Series: -; REACH SVHC: No SVHC; Length: 1mm; Dielectric: X7R; RoHS Compliant: Yes; Mount: Surface Mount; Packaging: Tape and Reel; Case/Package: 0402; Case Code (Imperial): 0402; Termination: SMD/SMT; Width: 0.02inch; Case Code (Metric): 1005; Tolerance: 10%
R142-R147 R150 R152 R166-R177 = CMP-2002-07709-1: as R96 on sheet 09-USBUart_PPSMUX_UARTMUX
R148 R149 R151 R153-R165 = CMP-2002-08434-1: as R13 on sheet 09-USBUart_PPSMUX_UARTMUX
U28 U29 = PI3A412ZHE: No Description Available; Mfr_Name: Pericom; RefDes: RefDes; Type: Type
U30 U31 = CMP-04892-000114-1: as U21 on sheet 09-USBUart_PPSMUX_UARTMUX; Number of Pins: 12; Min Operating Temperature: -40°C; RoHS Compliant: Yes; Max Operating Temperature: 125°C; Number of Channels: 2; Packaging: Tape and Reel

## Nets that join several sheets
+3.3V: 01-USER_IO (18 pins), 02-USER_IO_STATUS (15 pins), 03-POWER (21 pins), 04-PCIe_JTAG (7 pins), 05-GPS_IMU_SENSORS (20 pins), 06-MAC (5 pins), 08-DIPSwitches_I2C (24 pins), 09-USBUart_PPSMUX_UARTMUX (7 pins), 11-M2_RCB_MUX (8 pins)
+5.0V: 03-POWER (10 pins), 05-GPS_IMU_SENSORS (11 pins), 06-MAC (R45.2), 07-FPGA (8 pins), 09-USBUart_PPSMUX_UARTMUX (R180.2 U34.3 U34.5)
+12V: 03-POWER (32 pins), 06-MAC (R46.2)
+12V_PCIE: 03-POWER (CR1.3 R44.1), 04-PCIe_JTAG (5 pins)
GND: 01-USER_IO (34 pins), 02-USER_IO_STATUS (10 pins), 03-POWER (92 pins), 04-PCIe_JTAG (27 pins), 05-GPS_IMU_SENSORS (52 pins), 06-MAC (18 pins), 07-FPGA (56 pins), 08-DIPSwitches_I2C (16 pins), 09-USBUart_PPSMUX_UARTMUX (44 pins), 11-M2_RCB_MUX (14 pins)
GNSS2_P3V3: 05-GPS_IMU_SENSORS (7 pins), 09-USBUart_PPSMUX_UARTMUX (5 pins)
GNSS2_P5V0: 05-GPS_IMU_SENSORS (7 pins), 09-USBUart_PPSMUX_UARTMUX (C113.1 U34.2 U34.7)
ANADC_I2C_SCL: 05-GPS_IMU_SENSORS (P1.3), 08-DIPSwitches_I2C (R116.1 U27.8)
ANADC_I2C_SDA: 05-GPS_IMU_SENSORS (P1.4), 08-DIPSwitches_I2C (R115.1 U27.7)
ANT1_IN: 01-USER_IO (U8.3), 07-FPGA (J35.21)
ANT1_IO_IN: 01-USER_IO (R15.2 U8.7), 07-FPGA (J36.33)
ANT1_IO_OUT: 01-USER_IO (R14.2 U8.1), 07-FPGA (J36.31)
ANT1_OUT: 01-USER_IO (U8.2), 07-FPGA (J35.15)
ANT2_IN: 01-USER_IO (U12.3), 07-FPGA (J35.23)
ANT2_IO_IN: 01-USER_IO (R30.2 U12.7), 07-FPGA (J36.37)
ANT2_IO_OUT: 01-USER_IO (R29.2 U12.1), 07-FPGA (J36.35)
ANT2_OUT: 01-USER_IO (U12.2), 07-FPGA (J35.17)
ANT3_IN: 01-USER_IO (U11.3), 07-FPGA (J35.16)
ANT3_IO_IN: 01-USER_IO (R16.2 U11.7), 07-FPGA (J36.43)
ANT3_IO_OUT: 01-USER_IO (R17.2 U11.1), 07-FPGA (J36.41)
ANT3_OUT: 01-USER_IO (U11.2), 07-FPGA (J35.25)
ANT4_IN: 01-USER_IO (U16.3), 07-FPGA (J35.18)
ANT4_IO_IN: 01-USER_IO (R32.2 U16.7), 07-FPGA (J36.47)
ANT4_IO_OUT: 01-USER_IO (R31.2 U16.1), 07-FPGA (J36.45)
ANT4_OUT: 01-USER_IO (U16.2), 07-FPGA (J35.27)
BNO_INT: 05-GPS_IMU_SENSORS (R50.2 U13.14), 07-FPGA (J35.63)
DC_I2C_SCL: 05-GPS_IMU_SENSORS (P5.3), 08-DIPSwitches_I2C (R114.1 U27.10)
DC_I2C_SDA: 05-GPS_IMU_SENSORS (P5.4), 08-DIPSwitches_I2C (R113.1 U27.9)
DIP_SW_GPS1_SEL: 08-DIPSwitches_I2C (R141.2 R179.2 SW2.3), 11-M2_RCB_MUX (U29.2 U29.10 U31.1 U31.5)
DIP_SW_GPS2_SEL: 08-DIPSwitches_I2C (R140.2 R178.2 SW2.4), 11-M2_RCB_MUX (U28.2 U28.10 U30.1 U30.5)
DIP_SW_PPS_SEL: 08-DIPSwitches_I2C (R88.2 R122.2 SW1.7), 09-USBUart_PPSMUX_UARTMUX (U23.1 U23.5)
DIP_SW_UART_SEL: 08-DIPSwitches_I2C (R78.2 R112.2 SW1.8), 09-USBUart_PPSMUX_UARTMUX (U21.1 U21.5 U22.1 U22.5)
EXT_EEPROM_WP: 05-GPS_IMU_SENSORS (R37.1 U7.5), 07-FPGA (J34.44)
EXT_GPIO_1: 05-GPS_IMU_SENSORS (P3.1), 07-FPGA (J36.42)
EXT_GPIO_2: 05-GPS_IMU_SENSORS (P3.2), 07-FPGA (J36.44)
EXT_GPIO_3: 05-GPS_IMU_SENSORS (P3.3), 07-FPGA (J36.46)
EXT_GPIO_4: 05-GPS_IMU_SENSORS (P3.4), 07-FPGA (J36.48)
EXT_GPIO_7: 05-GPS_IMU_SENSORS (P3.7), 07-FPGA (J36.32)
EXT_GPIO_8: 05-GPS_IMU_SENSORS (P3.8), 07-FPGA (J36.34)
EXT_GPIO_9: 05-GPS_IMU_SENSORS (P3.9), 07-FPGA (J36.36)
EXT_GPIO_10: 05-GPS_IMU_SENSORS (P3.10), 07-FPGA (J36.38)
FPGA_BNO_XIN32: 05-GPS_IMU_SENSORS (R71.2), 07-FPGA (J35.36)
FPGA_BNO_XOUT32: 05-GPS_IMU_SENSORS (R73.2), 07-FPGA (J35.38)
FPGA_MAC_PPS_DIFF_IN0: 06-MAC (R11.2 U3.3), 09-USBUart_PPSMUX_UARTMUX (R99.1 R107.2)
FPGA_MAC_PPS_IN0-: 07-FPGA (J35.47), 09-USBUart_PPSMUX_UARTMUX (R106.1 R107.1 U23.7)
FPGA_MAC_PPS_IN1-: 06-MAC (R10.2 U3.2), 07-FPGA (J35.53)
FPGA_MAC_PPS_OUT-: 07-FPGA (J35.43), 09-USBUart_PPSMUX_UARTMUX (R104.1 R105.1 U23.11)
FPGA_MAC_PPSDIFF_OUT: 06-MAC (U4.7), 09-USBUart_PPSMUX_UARTMUX (R97.1 R105.2)
FPGA_MAC_UART_TX: 07-FPGA (J35.26), 08-DIPSwitches_I2C (R74.1 R94.1)
FPGA_TCK: 04-PCIe_JTAG (D5.3 R18.1), 07-FPGA (J36.77)
FPGA_TDI: 04-PCIe_JTAG (D8.3 R21.1), 07-FPGA (J36.78)
FPGA_TDO: 04-PCIe_JTAG (D6.3 R19.1), 07-FPGA (J36.79)
FPGA_TMS: 04-PCIe_JTAG (D7.3 R20.1), 07-FPGA (J36.80)
GPS1_PIN11: 07-FPGA (J35.4), 11-M2_RCB_MUX (R170.1 R172.1 R176.2)
GPS1_PIN12: 07-FPGA (J35.5), 11-M2_RCB_MUX (R173.1 R174.1 R177.2)
GPS1_PIN13: 05-GPS_IMU_SENSORS (J6.13), 07-FPGA (J35.2)
GPS1_PIN14: 05-GPS_IMU_SENSORS (J6.14), 07-FPGA (J35.3)
GPS1_PIN15: 05-GPS_IMU_SENSORS (J6.15), 07-FPGA (J35.1)
GPS1_RST: 05-GPS_IMU_SENSORS (J6.4 U9.4), 07-FPGA (J34.22)
GPS1_RX: 07-FPGA (J35.79), 11-M2_RCB_MUX (R152.2 R157.2 R163.2)
GPS1_TP1: 07-FPGA (J34.32), 11-M2_RCB_MUX (R150.2 R159.2 R164.2)
GPS1_TP2: 07-FPGA (J34.34), 11-M2_RCB_MUX (R147.2 R161.2 R165.2)
GPS1_TX: 07-FPGA (J35.80), 11-M2_RCB_MUX (R144.2 R155.2 R162.2)
GPS2_PIN11: 07-FPGA (J35.75), 11-M2_RCB_MUX (R166.1 R167.1 R171.2)
GPS2_PIN12: 07-FPGA (J35.76), 11-M2_RCB_MUX (R168.1 R169.1 R175.2)
GPS2_PIN13: 05-GPS_IMU_SENSORS (J13.13), 07-FPGA (J35.73)
GPS2_PIN14: 05-GPS_IMU_SENSORS (J13.14), 07-FPGA (J35.78)
GPS2_PIN15: 05-GPS_IMU_SENSORS (J13.15), 07-FPGA (J35.65)
GPS2_RST: 05-GPS_IMU_SENSORS (J13.4 U15.4), 07-FPGA (J36.11)
GPS2_RX: 09-USBUart_PPSMUX_UARTMUX (R103.2 U22.7), 11-M2_RCB_MUX (R146.2 R149.2 R156.2)
GPS2_RX_FPGA: 07-FPGA (J36.2), 09-USBUart_PPSMUX_UARTMUX (R93.1 R103.1)
GPS2_TP1: 07-FPGA (J36.5), 11-M2_RCB_MUX (R145.2 R151.2 R158.2)
GPS2_TP2: 07-FPGA (J36.7), 11-M2_RCB_MUX (R143.2 R153.2 R160.2)
GPS2_TX: 09-USBUart_PPSMUX_UARTMUX (R102.2 U22.11), 11-M2_RCB_MUX (R142.2 R148.2 R154.2)
GPS2_TX_FPGA: 07-FPGA (J36.1), 09-USBUart_PPSMUX_UARTMUX (R91.1 R102.1)
LED1: 02-USER_IO_STATUS (R35.1), 07-FPGA (J34.77)
LED2: 02-USER_IO_STATUS (R36.1), 07-FPGA (J34.75)
LED3: 02-USER_IO_STATUS (R38.1), 07-FPGA (J34.73)
LED4: 02-USER_IO_STATUS (R39.1), 07-FPGA (J34.71)
MAC_ALARM: 06-MAC (J31.20 U10.20), 07-FPGA (J35.35)
MAC_BITE: 06-MAC (SKT4.1 U10.P6), 07-FPGA (J35.37)
MAC_FPGA_UART_RX: 07-FPGA (J35.28), 08-DIPSwitches_I2C (R75.1 R111.1)
MAC_FREQ_CTRL: 05-GPS_IMU_SENSORS (R48.2 R186.2), 06-MAC (SKT2.1 U10.P1)
MAC_PPS_IN: 06-MAC (SKT8.1 U10.P9), 09-USBUart_PPSMUX_UARTMUX (R98.1 R106.2)
MAC_PPS_OUT: 06-MAC (SKT10.1 U10.P10), 09-USBUart_PPSMUX_UARTMUX (R96.1 R104.2)
MAC_RF_OUT: 06-MAC (SKT5.1 U10.P3), 07-FPGA (J35.11 J35.13)
MAC_RX: 06-MAC (SKT3.1 U10.P7), 08-DIPSwitches_I2C (R75.2 U26.7)
MAC_TX: 06-MAC (SKT1.1 U10.P8), 08-DIPSwitches_I2C (R74.2 U26.11)
MAC_USB+: 06-MAC (J31.2 U10.2), 07-FPGA (J35.72)
MAC_USB-: 06-MAC (J31.4 U10.4), 07-FPGA (J35.74)
MAC_USB_PWR: 06-MAC (J31.6 U10.6), 07-FPGA (J35.8)
PCIE_CLK_N: 04-PCIe_JTAG (C45.2), 07-FPGA (J37.38)
PCIE_CLK_P: 04-PCIe_JTAG (C44.2), 07-FPGA (J37.36)
PCIE_PERST: 04-PCIe_JTAG (P2.A11 R22.1), 05-GPS_IMU_SENSORS (R54.1), 07-FPGA (J36.21), 08-DIPSwitches_I2C (R121.1)
PCIE_RX0_N: 04-PCIe_JTAG (P2.B15), 07-FPGA (J37.37)
PCIE_RX0_P: 04-PCIe_JTAG (P2.B14), 07-FPGA (J37.35)
PCIE_RX1_N: 04-PCIe_JTAG (P2.B20), 07-FPGA (J37.32)
PCIE_RX1_P: 04-PCIe_JTAG (P2.B19), 07-FPGA (J37.30)
PCIE_RX2_N: 04-PCIe_JTAG (P2.B24), 07-FPGA (J37.20)
PCIE_RX2_P: 04-PCIe_JTAG (P2.B23), 07-FPGA (J37.18)
PCIE_RX3_N: 04-PCIe_JTAG (P2.B28), 07-FPGA (J37.25)
PCIE_RX3_P: 04-PCIe_JTAG (P2.B27), 07-FPGA (J37.23)
PCIE_TX0_N: 04-PCIe_JTAG (C47.2), 07-FPGA (J37.31)
PCIE_TX0_P: 04-PCIe_JTAG (C46.2), 07-FPGA (J37.29)
PCIE_TX1_N: 04-PCIe_JTAG (C49.2), 07-FPGA (J37.26)
PCIE_TX1_P: 04-PCIe_JTAG (C48.2), 07-FPGA (J37.24)
PCIE_TX2_N: 04-PCIe_JTAG (C51.2), 07-FPGA (J37.14)
PCIE_TX2_P: 04-PCIe_JTAG (C50.2), 07-FPGA (J37.12)
PCIE_TX3_N: 04-PCIe_JTAG (C53.2), 07-FPGA (J37.19)
PCIE_TX3_P: 04-PCIe_JTAG (C52.2), 07-FPGA (J37.17)
RCB_GPS1_PIN11: 05-GPS_IMU_SENSORS (J6.11), 11-M2_RCB_MUX (R170.2 U31.10)
RCB_GPS1_PIN12: 05-GPS_IMU_SENSORS (J6.12), 11-M2_RCB_MUX (R173.2 U31.8)
RCB_GPS1_RX: 05-GPS_IMU_SENSORS (J6.5 U9.5), 11-M2_RCB_MUX (R157.1 U29.5)
RCB_GPS1_TP1: 05-GPS_IMU_SENSORS (J6.6 U9.6), 11-M2_RCB_MUX (R159.1 U29.9)
RCB_GPS1_TP2: 05-GPS_IMU_SENSORS (J6.7 U9.7), 11-M2_RCB_MUX (R161.1 U29.13)
RCB_GPS1_TX: 05-GPS_IMU_SENSORS (J6.3 U9.3), 11-M2_RCB_MUX (R155.1 U29.1)
RCB_GPS2_PIN11: 05-GPS_IMU_SENSORS (J13.11), 11-M2_RCB_MUX (R166.2 U30.10)
RCB_GPS2_PIN12: 05-GPS_IMU_SENSORS (J13.12), 11-M2_RCB_MUX (R168.2 U30.8)
RCB_GPS2_RX: 05-GPS_IMU_SENSORS (J13.5 U15.5), 11-M2_RCB_MUX (R149.1 U28.5)
RCB_GPS2_TP1: 05-GPS_IMU_SENSORS (J13.6 U15.6), 11-M2_RCB_MUX (R151.1 U28.9)
RCB_GPS2_TP2: 05-GPS_IMU_SENSORS (J13.7 U15.7), 11-M2_RCB_MUX (R153.1 U28.13)
RCB_GPS2_TX: 05-GPS_IMU_SENSORS (J13.3 U15.3), 11-M2_RCB_MUX (R148.1 U28.1)
SCL: 05-GPS_IMU_SENSORS (U7.1), 07-FPGA (J35.67), 08-DIPSwitches_I2C (R124.1 U27.12)
SDA: 05-GPS_IMU_SENSORS (U7.3), 07-FPGA (J35.61), 08-DIPSwitches_I2C (R123.1 U27.13)
SENS_I2C_SCL: 02-USER_IO_STATUS (U6.7), 03-POWER (U2.4 U17.4 U19.4), 05-GPS_IMU_SENSORS (U13.19 U14.4), 08-DIPSwitches_I2C (R118.1 U27.5)
SENS_I2C_SDA: 02-USER_IO_STATUS (U6.6), 03-POWER (U2.3 U17.3 U19.3), 05-GPS_IMU_SENSORS (U13.20 U14.3), 08-DIPSwitches_I2C (R117.1 U27.4)
UART1_RXD: 07-FPGA (J35.77), 09-USBUart_PPSMUX_UARTMUX (R101.2 U21.7)
UART1_TXD: 07-FPGA (J35.71), 09-USBUart_PPSMUX_UARTMUX (R100.2 U21.11)